# EAGLE design nevma (EAGLE 8.3.0)
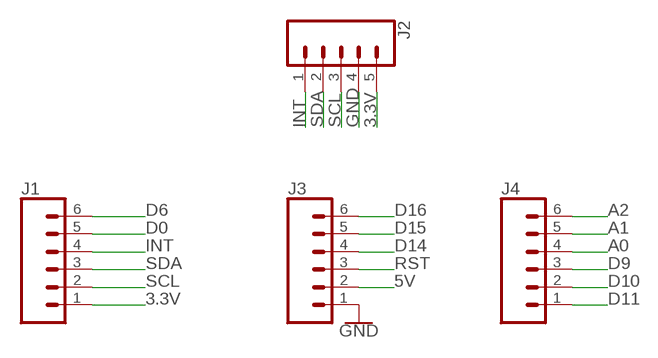
[diagram p0: schematic, sheet 1]

## Parts
J1  CONN_06LOCK  [1X06_LOCK]
J2  CONN_05LOCK  [1X05_LOCK]
J3  CONN_06LOCK  [1X06_LOCK]
J4  CONN_06LOCK  [1X06_LOCK]

## Nets
3.3V: J1.1 J2.5
5V: J3.2
A0: J4.4
A1: J4.5
A2: J4.6
D0: J1.5
D6: J1.6
D9: J4.3
D10: J4.2
D11: J4.1
D14: J3.4
D15: J3.5
D16: J3.6
GND: J2.4 J3.1
INT: J1.4 J2.1
RST: J3.3
SCL: J1.2 J2.3
SDA: J1.3 J2.2

## Library data of the parts
J1 J3 J4 = SparkFun-Connectors:CONN_06: Multi connection point. Often used as Generic Header-pin footprint for 0.1 inch spaced/style header connections On any of the 0.1 inch spaced packages, you can populate with these: Break Away Headers - Straight <https://www.sparkfun.com/products/116> (PRT-00116) Break Away Male Headers - Right Angle <https://www.sparkfun.com/products/553> (PRT-00553) Female Headers <https://www.sparkfun.com/products/115> (PRT-00115) Break Away Headers - Machine Pin <https://www.sparkfun.com/products/117> (PRT-00117) Break Away Female Headers - Swiss Machine Pin <https://www.sparkfun.com/products/743> (PRT-00743) Arduino Stackable Header - 6 Pin <https://www.sparkfun.com/products/9280> (PRT-09280) For SCREWTERMINALS and SPRING TERMINALS visit here: Screw Terimnals on SparkFun.com <https://www.sparkfun.com/search/results?term=Screw+Terminals> (5mm/3.5mm/2.54mm spacing) This device is also useful as a general connection point to wire up your design to another part of your project. Our various solder wires solder well into these plated through hole pads. Hook-Up Wire - Assortment (Stranded, 22 AWG) <https://www.sparkfun.com/products/11375> (PRT-11375) Hook-Up Wire - Assortment (Solid Core, 22 AWG) <https://www.sparkfun.com/products/11367> (PRT-11367) View the entire wire category on our website here <https://www.sparkfun.com/categories/141>
J2 = SparkFun-Connectors:CONN_05: Multi connection point. Often used as Generic Header-pin footprint for 0.1 inch spaced/style header connections On any of the 0.1 inch spaced packages, you can populate with these: Break Away Headers - Straight <https://www.sparkfun.com/products/116> (PRT-00116) Break Away Male Headers - Right Angle <https://www.sparkfun.com/products/553> (PRT-00553) Female Headers <https://www.sparkfun.com/products/115> (PRT-00115) Break Away Headers - Machine Pin <https://www.sparkfun.com/products/117> (PRT-00117) Break Away Female Headers - Swiss Machine Pin <https://www.sparkfun.com/products/743> (PRT-00743) For SCREWTERMINALS and SPRING TERMINALS visit here: Screw Terimnals on SparkFun.com <https://www.sparkfun.com/search/results?term=Screw+Terminals> (5mm/3.5mm/2.54mm spacing) This device is also useful as a general connection point to wire up your design to another part of your project. Our various solder wires solder well into these plated through hole pads. Hook-Up Wire - Assortment (Stranded, 22 AWG) <https://www.sparkfun.com/products/11375> (PRT-11375) Hook-Up Wire - Assortment (Solid Core, 22 AWG) <https://www.sparkfun.com/products/11367> (PRT-11367) View the entire wire category on our website here <https://www.sparkfun.com/categories/141> Special notes: Molex polarized connector foot print use with SKU : PRT-08231 with associated crimp pins and housings. 1MM SMD Version SKU: PRT-10208

## Board
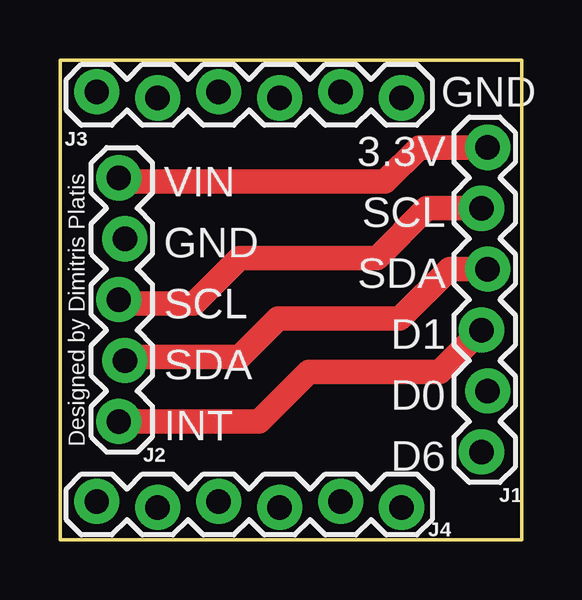
[diagram p1: board, top side]
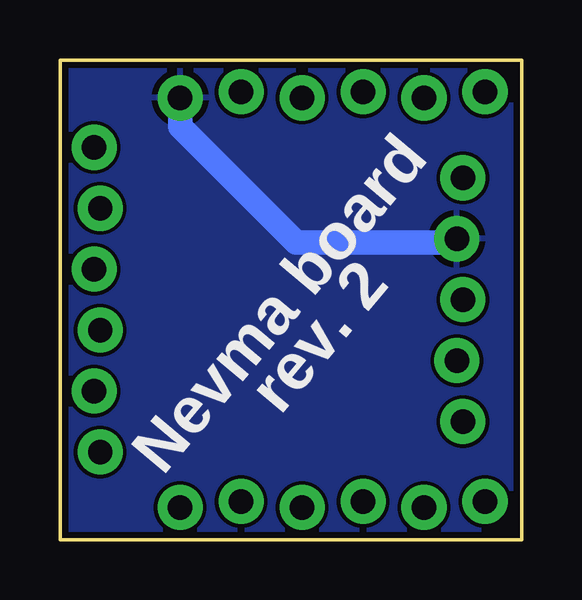
[diagram p2: board, bottom side, seen from below]

Size 19.24 x 20 mm. Coordinates in mm from the lower left corner, seen from the top.
Outline: 0,20 19.24,20 19.24,0 0,0 0,20
Copper layers (1*16): Top 0.035mm / dielectric 1.5mm / Bottom 0.035mm
Design rules "SeeedStudio_2layer_DRU_edited": minimum track width 7mil, minimum drill 15mil, track to track 6mil, track to pad 6mil, pad to pad 6mil, via to via 6mil, smd to smd 0mil, copper to edge 10mil, drill to drill 10mil, minimum pad ring 10mil, minimum via ring 6mil, stop-mask expansion 2mil, vias tented up to drill 100mil, thermal gap 10mil

### Footprints (pad centres in the part's own frame; a part is rotated, then mirrored left to right if it is on the bottom)
1X06_LOCK = drill 1.016 pad 1.88: 1 0,0; 2 2.54,-0.254; 3 5.08,0; 4 7.62,-0.254; 5 10.16,0; 6 12.7,-0.254
1X05_LOCK = drill 1.016 pad 1.88: 1 0,0.127; 2 2.54,-0.127; 3 5.08,0.127; 4 7.62,-0.127; 5 10.16,0.127

### Placement (x,y rotation side)
J1  17.82,16.35 270 top
J2  2.58,4.92 90 top
J3  14.23,18.42 180 top
J4  14.23,1.34 180 top

### Tracks (layer width: path | path; a pad name or v marks a point on that pad's centre or on a via)
3.3V
  Top 1.016: J1.1 14.96,16.35 13.53,14.92 2.61,14.92 J2.5
GND
  Bottom 1.016: J2.4 2.86,12.38 9.4,12.38 14.23,17.21 J3.1
  pour Bottom: 0.01,20.01 19.25,20.01 19.25,0 0.01,0
INT
  Top 1.016: J2.1 8.29,4.92 10.35,6.99 15.82,6.99 J1.4
SCL
  Top 1.016: J1.2 15.28,13.81 13.21,11.75 7.5,11.75 5.59,9.84 2.61,9.84 J2.3
SDA
  Top 1.016: J1.3 16.23,11.27 14.17,9.21 9.09,9.21 7.5,7.62 2.86,7.62 J2.2

### Text on the board
tPlace: GND | VIN / GND / SCL / SDA / INT | 3.3V / SCL / SDA / D1 / D0 / D6 | Designed by Dimitris Platis
bPlace: Nevma board / rev. 2